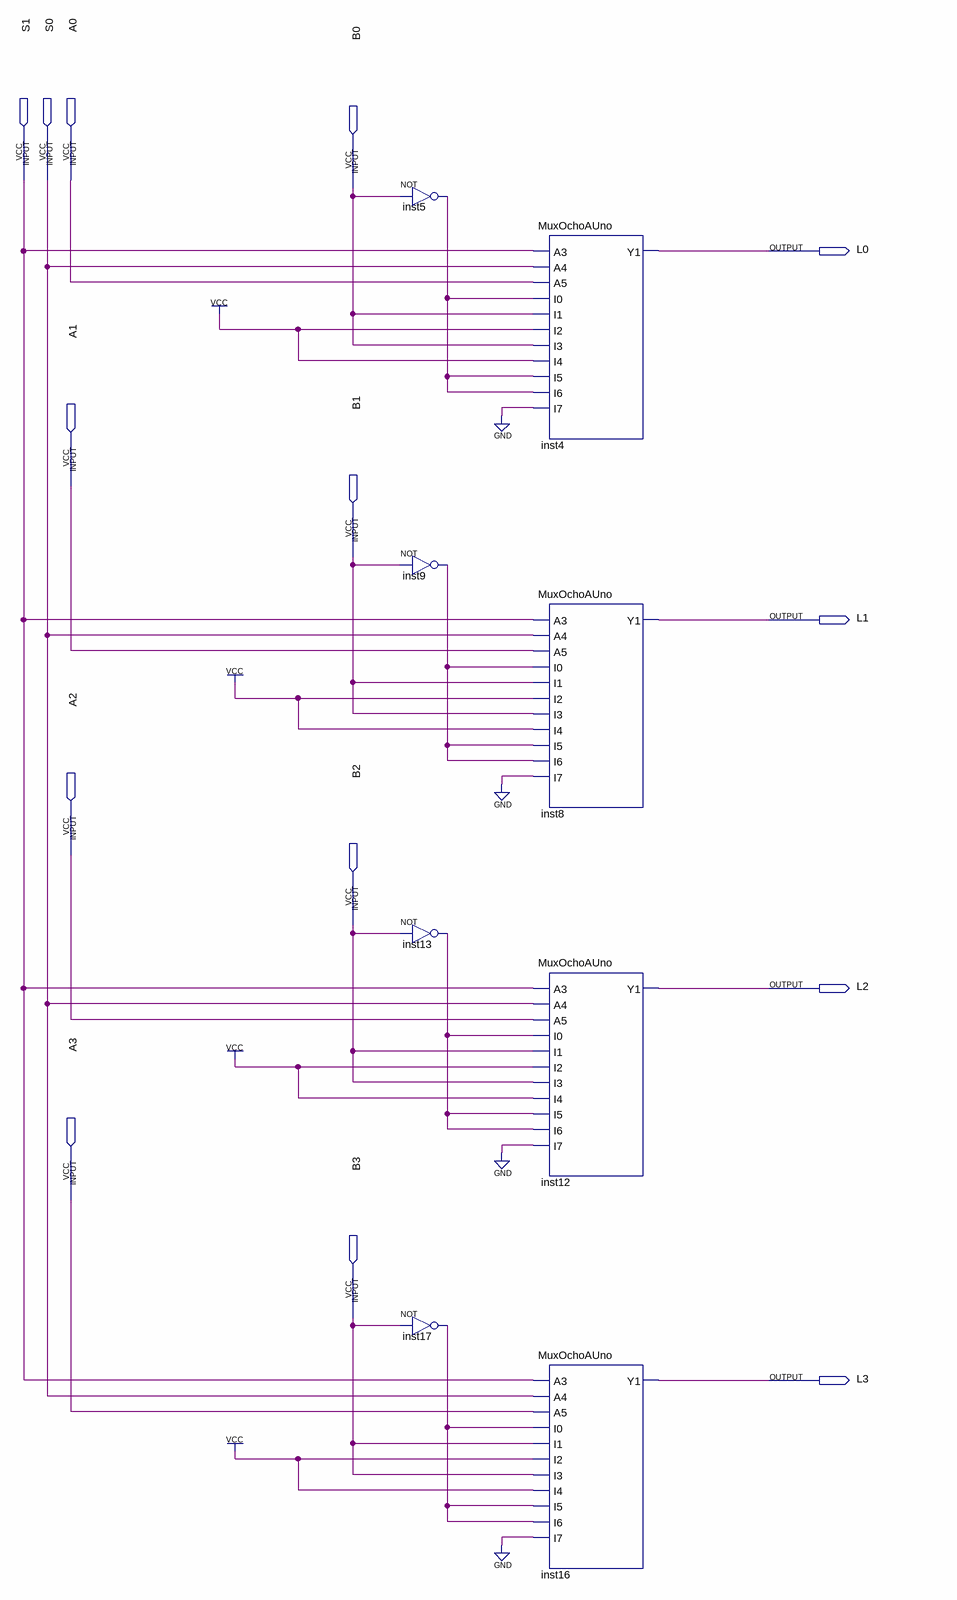
[diagram p0: schematic sheet]
// Quartus schematic BloqueLogico.bdf as structural Verilog: 8 symbols, 14 pins
module BloqueLogico (
  input  S1,
  input  S0,
  input  A0,
  input  B0,
  input  A1,
  input  B1,
  input  A2,
  input  B2,
  input  A3,
  input  B3,
  output L0,
  output L1,
  output L2,
  output L3
);

  wire inst5_out, inst9_out, inst13_out, inst17_out;

  not inst5 (inst5_out, B0);
  not inst9 (inst9_out, B1);
  not inst13 (inst13_out, B2);
  not inst17 (inst17_out, B3);
  MuxOchoAUno inst4 (
    .A3(S1), .A4(S0), .A5(A0), .I0(inst5_out), .I1(B0), .I2(1'b1), .I3(B0), .I4(1'b1), .I5(inst5_out),
    .I6(inst5_out), .I7(1'b0), .Y1(L0));
  MuxOchoAUno inst8 (
    .A3(S1), .A4(S0), .A5(A1), .I0(inst9_out), .I1(B1), .I2(1'b1), .I3(B1), .I4(1'b1), .I5(inst9_out),
    .I6(inst9_out), .I7(1'b0), .Y1(L1));
  MuxOchoAUno inst12 (
    .A3(S1), .A4(S0), .A5(A2), .I0(inst13_out), .I1(B2), .I2(1'b1), .I3(B2), .I4(1'b1), .I5(inst13_out),
    .I6(inst13_out), .I7(1'b0), .Y1(L2));
  MuxOchoAUno inst16 (
    .A3(S1), .A4(S0), .A5(A3), .I0(inst17_out), .I1(B3), .I2(1'b1), .I3(B3), .I4(1'b1), .I5(inst17_out),
    .I6(inst17_out), .I7(1'b0), .Y1(L3));
endmodule
